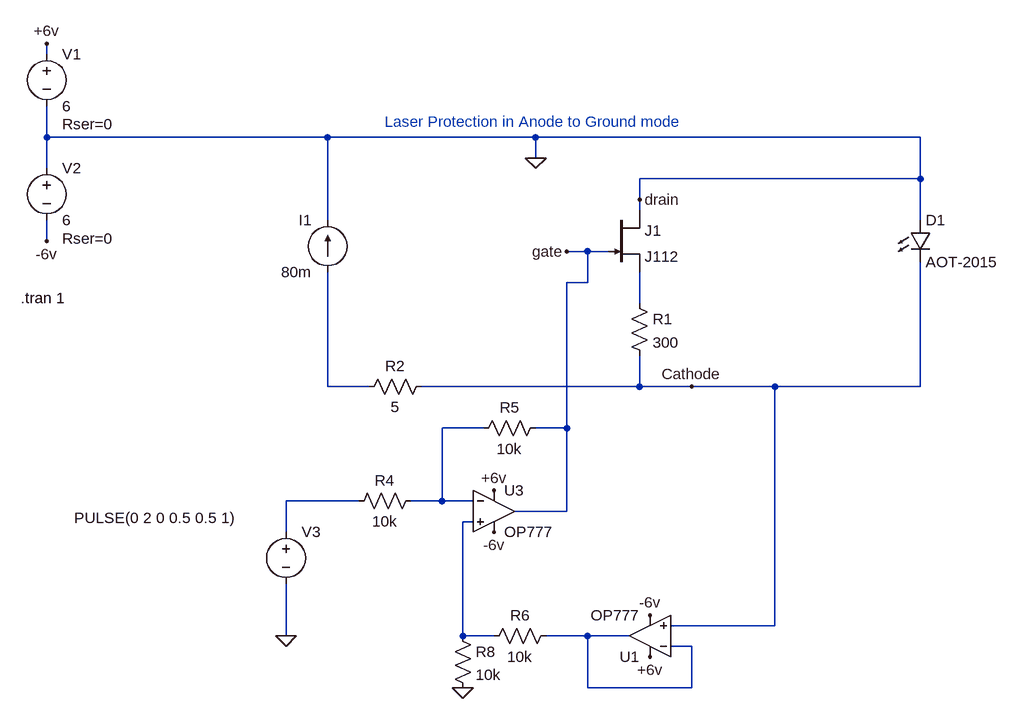
[diagram p0: schematic FetDirectGateAnodeGrounded.asc]
FetDirectGateAnodeGrounded.asc, the LTspice schematic file:
Version 4
SHEET 1 1528 1276
WIRE -48 176 -48 160
WIRE -48 304 -48 256
WIRE 384 304 -48 304
WIRE 704 304 384 304
WIRE 1296 304 704 304
WIRE 704 336 704 304
WIRE -48 352 -48 304
WIRE 1296 368 1296 304
WIRE 1296 368 864 368
WIRE 864 400 864 368
WIRE 864 416 864 400
WIRE 384 432 384 304
WIRE 1296 432 1296 368
WIRE -48 464 -48 432
WIRE 784 480 752 480
WIRE 816 480 784 480
WIRE 784 528 784 480
WIRE 784 528 752 528
WIRE 864 560 864 512
WIRE 384 688 384 512
WIRE 448 688 384 688
WIRE 864 688 864 640
WIRE 864 688 528 688
WIRE 944 688 864 688
WIRE 1072 688 944 688
WIRE 1296 688 1296 496
WIRE 1296 688 1072 688
WIRE 624 752 560 752
WIRE 752 752 752 528
WIRE 752 752 704 752
WIRE 432 864 320 864
WIRE 560 864 560 752
WIRE 560 864 512 864
WIRE 608 864 560 864
WIRE 752 880 752 752
WIRE 752 880 672 880
WIRE 608 896 592 896
WIRE 320 912 320 864
WIRE 1072 1056 1072 688
WIRE 1072 1056 912 1056
WIRE 320 1072 320 992
WIRE 592 1072 592 896
WIRE 640 1072 592 1072
WIRE 784 1072 720 1072
WIRE 848 1072 784 1072
WIRE 944 1088 912 1088
WIRE 784 1152 784 1072
WIRE 944 1152 944 1088
WIRE 944 1152 784 1152
FLAG 704 336 0
FLAG 864 400 drain
FLAG 752 480 gate
FLAG -48 160 +6v
FLAG -48 464 -6v
FLAG 640 848 +6v
FLAG 640 912 -6v
FLAG 944 688 Cathode
FLAG 592 1152 0
FLAG 880 1040 -6v
FLAG 880 1104 +6v
FLAG 320 1072 0
SYMBOL current 384 512 R180
WINDOW 0 24 80 Left 2
WINDOW 3 24 0 Left 2
WINDOW 123 0 0 Left 0
WINDOW 39 0 0 Left 0
SYMATTR InstName I1
SYMATTR Value 80m
SYMBOL res 544 672 R90
WINDOW 0 0 56 VBottom 2
WINDOW 3 32 56 VTop 2
SYMATTR InstName R2
SYMATTR Value 5
SYMBOL njf 816 416 R0
SYMATTR InstName J1
SYMATTR Value J112
SYMBOL res 848 544 R0
SYMATTR InstName R1
SYMATTR Value 300
SYMBOL LED 1280 432 R0
SYMATTR InstName D1
SYMATTR Value AOT-2015
SYMBOL OpAmps\\OP777 640 816 R0
SYMATTR InstName U3
SYMBOL voltage -48 160 R0
WINDOW 123 0 0 Left 0
WINDOW 39 24 124 Left 2
SYMATTR SpiceLine Rser=0
SYMATTR InstName V1
SYMATTR Value 6
SYMBOL voltage -48 336 R0
WINDOW 123 0 0 Left 0
WINDOW 39 24 124 Left 2
SYMATTR SpiceLine Rser=0
SYMATTR InstName V2
SYMATTR Value 6
SYMBOL res 528 848 R90
WINDOW 0 0 56 VBottom 2
WINDOW 3 32 56 VTop 2
SYMATTR InstName R4
SYMATTR Value 10k
SYMBOL res 720 736 R90
WINDOW 0 0 56 VBottom 2
WINDOW 3 32 56 VTop 2
SYMATTR InstName R5
SYMATTR Value 10k
SYMBOL OpAmps\\OP777 880 1136 R180
SYMATTR InstName U1
SYMBOL res 736 1056 R90
WINDOW 0 0 56 VBottom 2
WINDOW 3 32 56 VTop 2
SYMATTR InstName R6
SYMATTR Value 10k
SYMBOL res 576 1056 R0
SYMATTR InstName R8
SYMATTR Value 10k
SYMBOL voltage 320 896 R0
WINDOW 3 -326 -6 Left 2
WINDOW 123 0 0 Left 0
WINDOW 39 0 0 Left 0
SYMATTR Value PULSE(0 2 0 0.5 0.5 1)
SYMATTR InstName V3
TEXT -88 552 Left 2 !.tran 1
TEXT 472 280 Left 2 ;Laser Protection in Anode to Ground mode

The netlist it stands for:
* FetDirectGateAnodeGrounded.asc
I1 N002 0 80m
R2 Cathode N002 5
J1 0 gate N001 J112
R1 N001 Cathode 300
D1 0 Cathode AOT-2015
XU3 N005 N003 +6v -6v gate OP777  ; pins In+ In- V+ V- OUT
V1 +6v 0 6 Rser=0
V2 0 -6v 6 Rser=0
R4 N003 N004 10k
R5 gate N003 10k
XU1 Cathode N006 +6v -6v N006 OP777  ; pins In+ In- V+ V- OUT
R6 N006 N005 10k
R8 N005 0 10k
V3 N004 0 PULSE(0 2 0 0.5 0.5 1)
.model D D
.lib standard.dio
.model NJF NJF
.model PJF PJF
.lib standard.jft
.tran 1
* Laser Protection in Anode to Ground mode
.lib ADI.lib
.backanno
.end